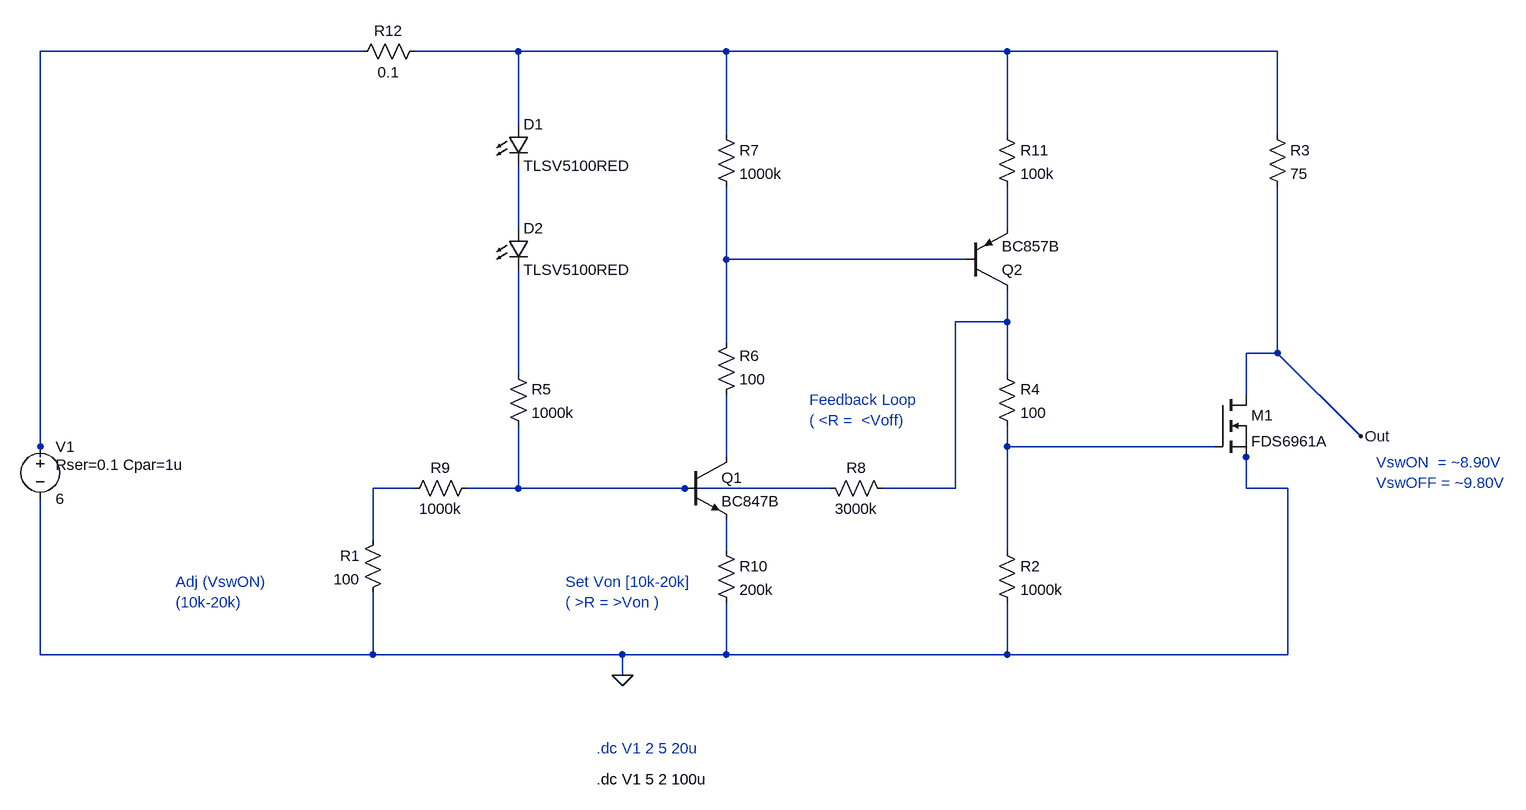
[diagram p0: schematic V0_SW20n.asc]
V0_SW20n.asc, the LTspice schematic file:
Version 4
SHEET 1 2188 680
WIRE -304 -560 -800 -560
WIRE -64 -560 -224 -560
WIRE 256 -560 -64 -560
WIRE 688 -560 256 -560
WIRE 1104 -560 688 -560
WIRE -64 -448 -64 -560
WIRE 256 -432 256 -560
WIRE 688 -432 688 -560
WIRE 1104 -432 1104 -560
WIRE -64 -288 -64 -384
WIRE 688 -288 688 -352
WIRE 256 -240 256 -352
WIRE 624 -240 256 -240
WIRE 688 -144 688 -192
WIRE 688 -144 608 -144
WIRE 256 -112 256 -240
WIRE 1104 -96 1104 -352
WIRE 1104 -96 1056 -96
WIRE -64 -64 -64 -224
WIRE 688 -64 688 -144
WIRE 1056 -32 1056 -96
WIRE 1232 32 1104 -96
WIRE -800 48 -800 -560
WIRE 688 48 688 16
WIRE 1008 48 688 48
WIRE -800 64 -800 48
WIRE 256 64 256 -32
WIRE 1056 64 1056 16
WIRE -224 112 -288 112
WIRE -64 112 -64 16
WIRE -64 112 -144 112
WIRE 192 112 -64 112
WIRE 416 112 192 112
WIRE 608 112 608 -144
WIRE 608 112 496 112
WIRE 1056 112 1056 64
WIRE 1120 112 1056 112
WIRE -288 192 -288 112
WIRE 256 208 256 160
WIRE 688 208 688 48
WIRE -800 368 -800 128
WIRE -288 368 -288 272
WIRE -288 368 -800 368
WIRE 96 368 -288 368
WIRE 256 368 256 288
WIRE 256 368 96 368
WIRE 688 368 688 288
WIRE 688 368 256 368
WIRE 1120 368 1120 112
WIRE 1120 368 688 368
WIRE 96 400 96 368
FLAG 96 400 0
FLAG 1232 32 Out
SYMBOL res -80 -80 R0
SYMATTR InstName R5
SYMATTR Value 1000k
SYMBOL res 1088 -448 R0
SYMATTR InstName R3
SYMATTR Value 75
SYMBOL voltage -800 32 R0
WINDOW 123 0 0 Left 0
WINDOW 39 24 44 Left 2
SYMATTR SpiceLine Rser=0.1 Cpar=1u
SYMATTR InstName V1
SYMATTR Value 6
SYMBOL res 240 -16 M180
WINDOW 0 36 76 Left 2
WINDOW 3 36 40 Left 2
SYMATTR InstName R6
SYMATTR Value 100
SYMBOL pnp 624 -192 M180
SYMATTR InstName Q2
SYMATTR Value BC857B
SYMBOL res 240 -448 R0
SYMATTR InstName R7
SYMATTR Value 1000k
SYMBOL npn 192 64 R0
SYMATTR InstName Q1
SYMATTR Value BC847B
SYMBOL res 672 192 R0
SYMATTR InstName R2
SYMATTR Value 1000k
SYMBOL res 672 -80 R0
SYMATTR InstName R4
SYMATTR Value 100
SYMBOL res 400 96 M90
WINDOW 0 0 56 VBottom 2
WINDOW 3 32 56 VTop 2
SYMATTR InstName R8
SYMATTR Value 3000k
SYMBOL res -128 96 R90
WINDOW 0 0 56 VBottom 2
WINDOW 3 32 56 VTop 2
SYMATTR InstName R9
SYMATTR Value 1000k
SYMBOL res 240 192 R0
SYMATTR InstName R10
SYMATTR Value 200k
SYMBOL res -208 -576 R90
WINDOW 0 0 56 VBottom 2
WINDOW 3 32 56 VTop 2
SYMATTR InstName R12
SYMATTR Value 0.1
SYMBOL res 672 -448 R0
SYMATTR InstName R11
SYMATTR Value 100k
SYMBOL LED -80 -448 R0
SYMATTR InstName D1
SYMATTR Value TLSV5100RED
SYMBOL LED -80 -288 R0
SYMATTR InstName D2
SYMATTR Value TLSV5100RED
SYMBOL res -272 176 M0
SYMATTR InstName R1
SYMATTR Value 100
SYMBOL nmos 1008 -32 R0
SYMATTR InstName M1
SYMATTR Value FDS6961A
TEXT 56 512 Left 2 ;.dc V1 2 5 20u
TEXT 56 560 Left 2 !.dc V1 5 2 100u
TEXT 8 256 Left 2 ;Set Von [10k-20k]\n( >R = >Von )
TEXT 384 -24 Left 2 ;Feedback Loop\n( <R =  <Voff)
TEXT 1256 72 Left 2 ;VswON  = ~8.90V\nVswOFF = ~9.80V
TEXT -592 256 Left 2 ;Adj (VswON)\n(10k-20k)

The netlist it stands for:
* V0_SW20n.asc
R5 N007 N011 1000k
R3 N002 Out 75
V1 N001 0 6 Rser=0.1 Cpar=1u
R6 N009 N005 100
Q2 N006 N005 N004 0 BC857B
R7 N002 N005 1000k
Q1 N009 N011 N012 0 BC847B
R2 N008 0 1000k
R4 N006 N008 100
R8 N011 N006 3000k
R9 N011 N010 1000k
R10 N012 0 200k
R12 N002 N001 0.1
R11 N002 N004 100k
D1 N002 N003 TLSV5100RED
D2 N003 N007 TLSV5100RED
R1 N010 0 100
M1 Out N008 0 0 FDS6961A
.model D D
.lib standard.dio
.model NPN NPN
.model PNP PNP
.lib standard.bjt
.model NMOS NMOS
.model PMOS PMOS
.lib standard.mos
* .dc V1 2 5 20u
.dc V1 5 2 100u
* Set Von [10k-20k]
* ( >R = >Von )
* Feedback Loop
* ( <R =  <Voff)
* VswON  = ~8.90V
* VswOFF = ~9.80V
* Adj (VswON)
* (10k-20k)
.backanno
.end